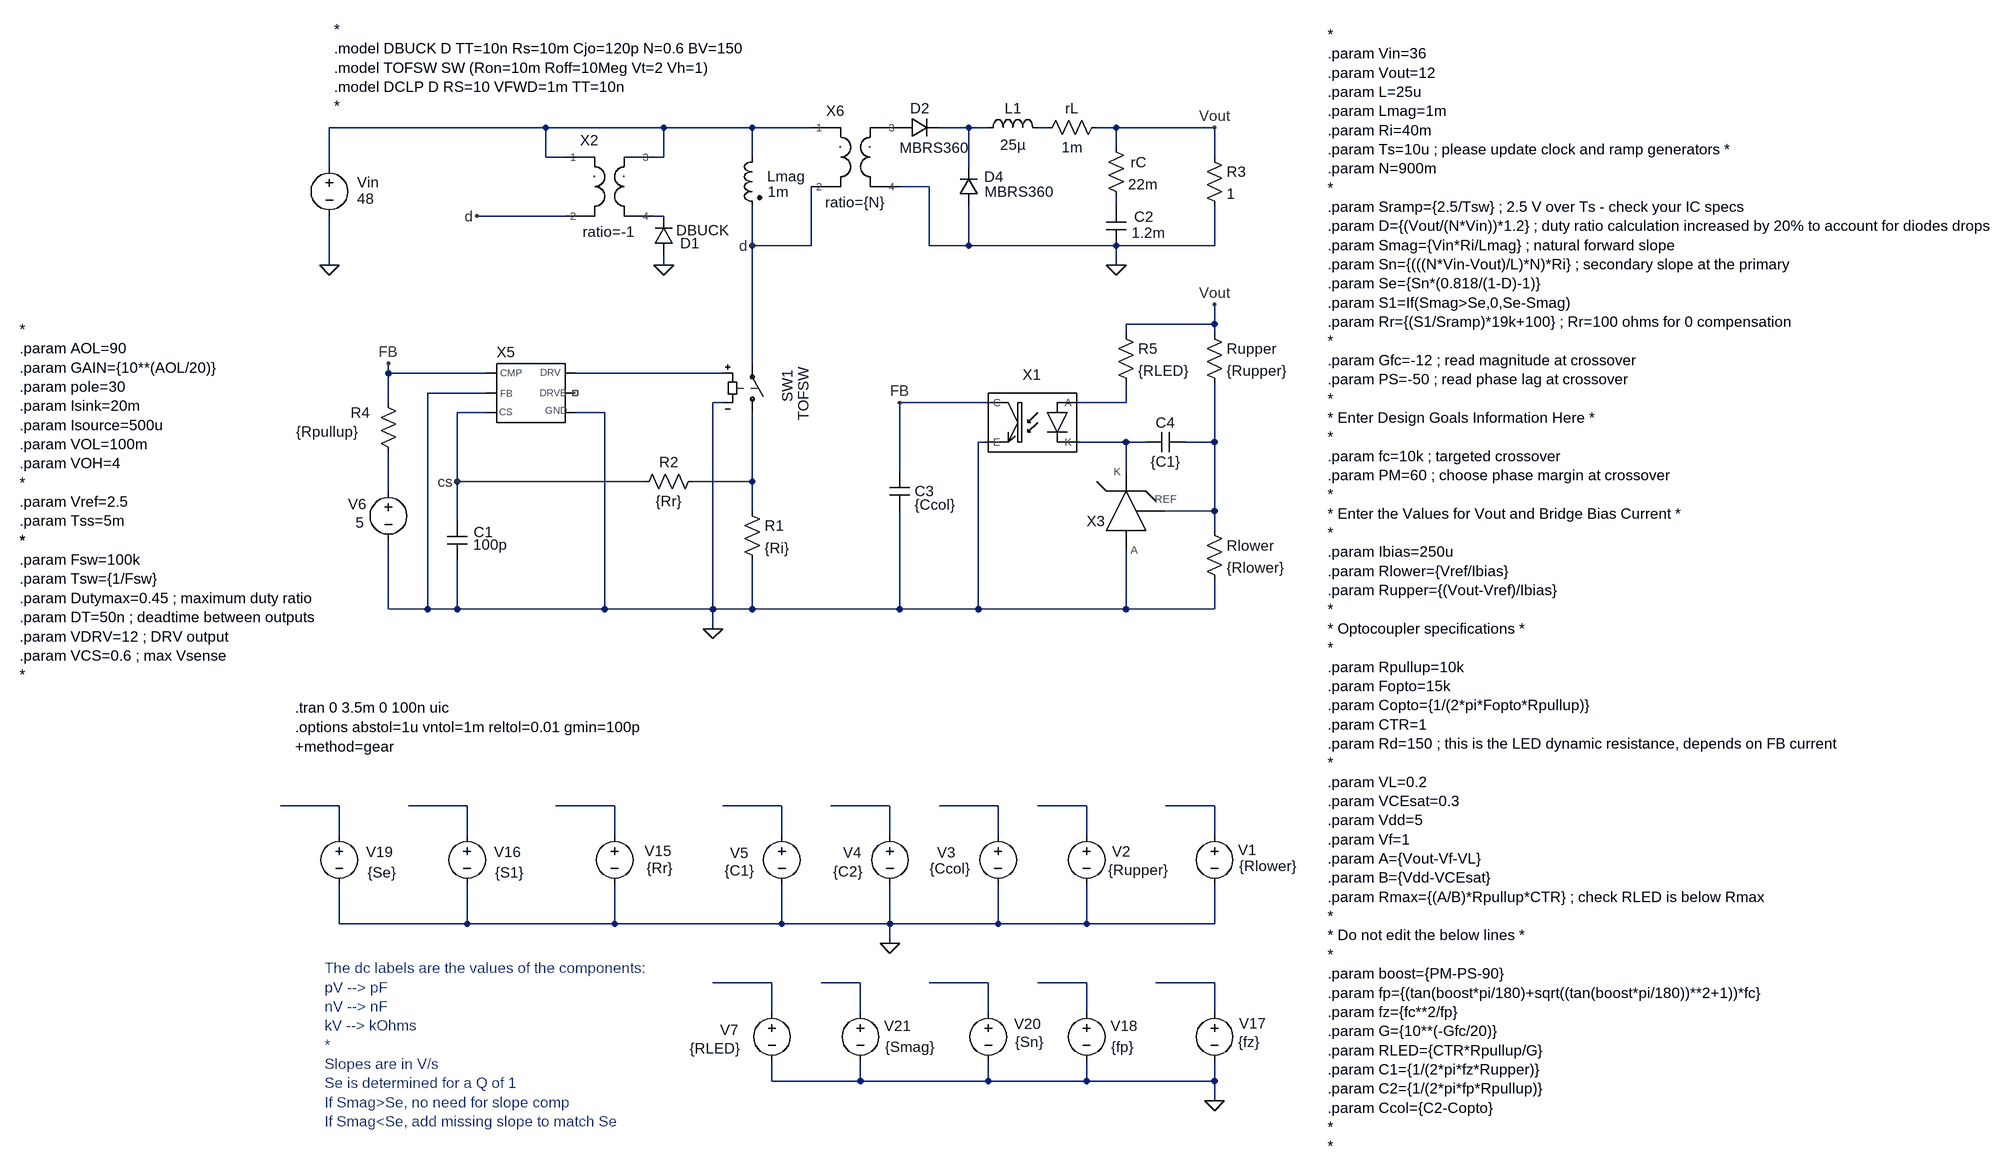
[diagram p0: schematic Forward CM - isolated - cbc.asc]
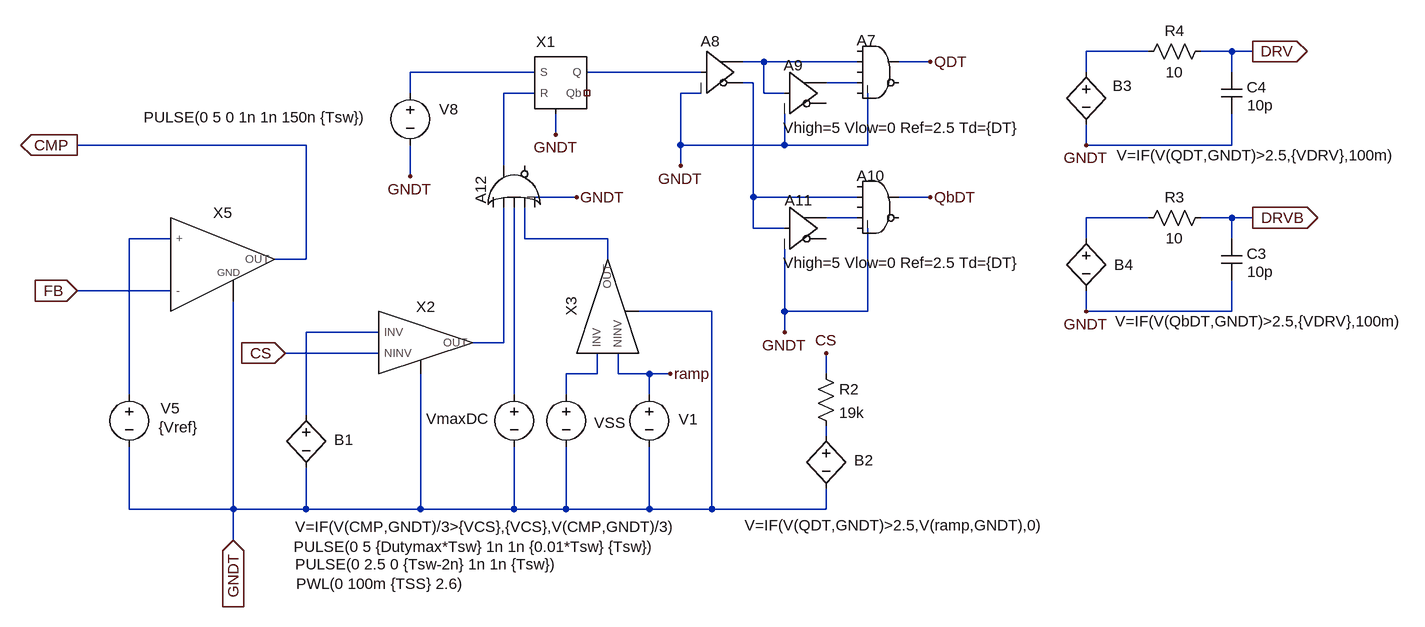
[diagram p1: sub-circuit generic_cm_pwm.asc]
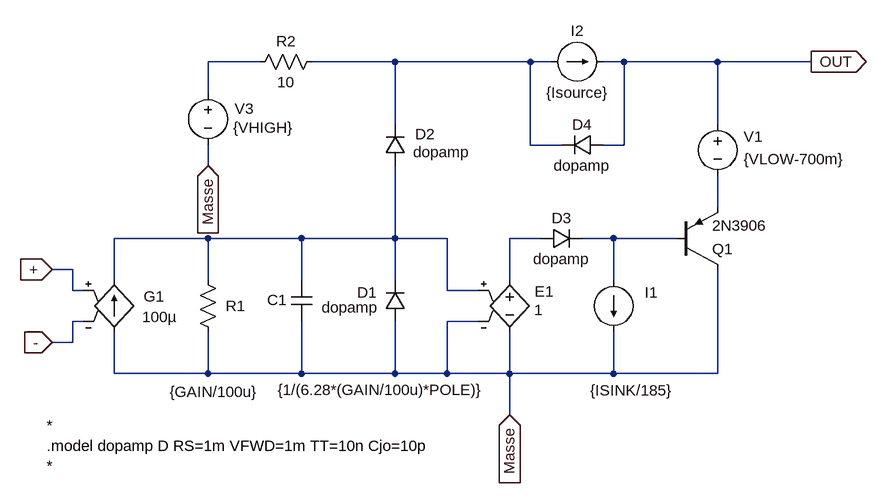
[diagram p2: sub-circuit op_amp_fan_out.asc]
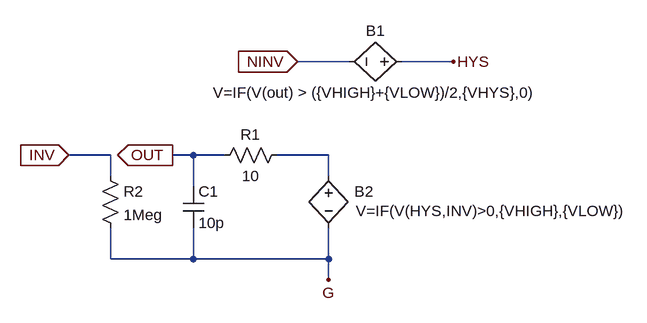
[diagram p3: sub-circuit comptof_g.asc]
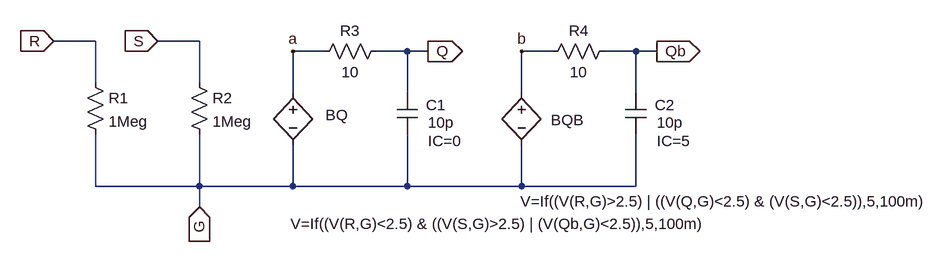
[diagram p4: sub-circuit sr_latch_g.asc]
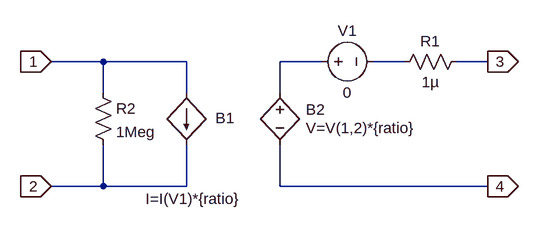
[diagram p5: sub-circuit xfmr.asc]
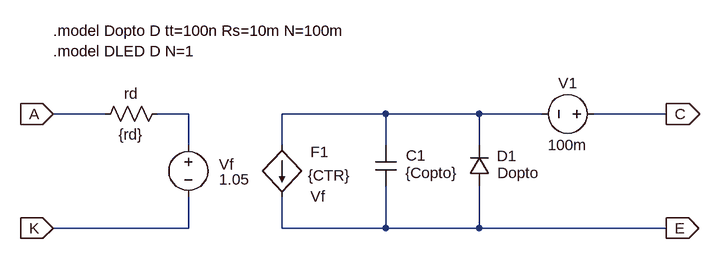
[diagram p6: sub-circuit optotof.asc]
Forward CM - isolated - cbc.asc, the LTspice schematic file:
Version 4.1
SHEET 1 2552 1992
WIRE -160 -208 -512 -208
WIRE 32 -208 -160 -208
WIRE 176 -208 32 -208
WIRE 272 -208 176 -208
WIRE 528 -208 480 -208
WIRE 560 -208 528 -208
WIRE 656 -208 640 -208
WIRE 768 -208 736 -208
WIRE 928 -208 768 -208
WIRE 768 -176 768 -208
WIRE -160 -160 -160 -208
WIRE -128 -160 -160 -160
WIRE 32 -160 32 -208
WIRE 32 -160 16 -160
WIRE 176 -160 176 -208
WIRE 928 -160 928 -208
WIRE -512 -144 -512 -208
WIRE 528 -144 528 -208
WIRE 464 -112 416 -112
WIRE 768 -80 768 -96
WIRE -128 -64 -272 -64
WIRE 32 -64 16 -64
WIRE 176 -16 176 -80
WIRE 272 -16 272 -112
WIRE 272 -16 176 -16
WIRE 464 -16 464 -112
WIRE 528 -16 528 -80
WIRE 528 -16 464 -16
WIRE 768 -16 528 -16
WIRE 928 -16 928 -80
WIRE 928 -16 768 -16
WIRE -512 16 -512 -64
WIRE 32 16 32 0
WIRE 768 16 768 -16
WIRE 928 112 928 80
WIRE 928 112 784 112
WIRE 784 128 784 112
WIRE 928 128 928 112
WIRE 176 176 176 -16
WIRE -416 192 -416 176
WIRE -256 192 -416 192
WIRE 128 192 -112 192
WIRE -256 224 -352 224
WIRE -416 240 -416 192
WIRE 128 240 112 240
WIRE 560 240 416 240
WIRE 784 240 784 208
WIRE 784 240 704 240
WIRE -256 256 -304 256
WIRE -64 256 -112 256
WIRE 560 304 544 304
WIRE 784 304 704 304
WIRE 816 304 784 304
WIRE 928 304 928 208
WIRE 928 304 880 304
WIRE 416 352 416 240
WIRE 784 352 784 304
WIRE -304 368 -304 256
WIRE 0 368 -304 368
WIRE 176 368 176 256
WIRE 176 368 80 368
WIRE -416 384 -416 320
WIRE 176 416 176 368
WIRE 928 416 928 304
WIRE 928 416 848 416
WIRE -304 432 -304 368
WIRE 928 448 928 416
WIRE -416 576 -416 464
WIRE -352 576 -352 224
WIRE -352 576 -416 576
WIRE -304 576 -304 496
WIRE -304 576 -352 576
WIRE -64 576 -64 256
WIRE -64 576 -304 576
WIRE 112 576 112 240
WIRE 112 576 -64 576
WIRE 176 576 176 496
WIRE 176 576 112 576
WIRE 416 576 416 416
WIRE 416 576 176 576
WIRE 544 576 544 304
WIRE 544 576 416 576
WIRE 784 576 784 480
WIRE 784 576 544 576
WIRE 928 576 928 528
WIRE 928 576 784 576
WIRE 112 608 112 576
WIRE -496 896 -592 896
WIRE -288 896 -384 896
WIRE -48 896 -144 896
WIRE 224 896 128 896
WIRE 400 896 304 896
WIRE 576 896 480 896
WIRE 720 896 640 896
WIRE 928 896 848 896
WIRE -496 944 -496 896
WIRE -288 944 -288 896
WIRE -48 944 -48 896
WIRE 224 944 224 896
WIRE 400 944 400 896
WIRE 576 944 576 896
WIRE 720 944 720 896
WIRE 928 944 928 896
WIRE -496 1088 -496 1024
WIRE -288 1088 -288 1024
WIRE -288 1088 -496 1088
WIRE -48 1088 -48 1024
WIRE -48 1088 -288 1088
WIRE 224 1088 224 1024
WIRE 224 1088 -48 1088
WIRE 400 1088 400 1024
WIRE 400 1088 224 1088
WIRE 576 1088 576 1024
WIRE 576 1088 400 1088
WIRE 720 1088 720 1024
WIRE 720 1088 576 1088
WIRE 928 1088 928 1024
WIRE 928 1088 720 1088
WIRE 400 1120 400 1088
WIRE 208 1184 112 1184
WIRE 352 1184 288 1184
WIRE 560 1184 464 1184
WIRE 720 1184 640 1184
WIRE 928 1184 832 1184
WIRE 208 1232 208 1184
WIRE 352 1232 352 1184
WIRE 560 1232 560 1184
WIRE 720 1232 720 1184
WIRE 928 1232 928 1184
WIRE 208 1344 208 1312
WIRE 352 1344 352 1312
WIRE 352 1344 208 1344
WIRE 560 1344 560 1312
WIRE 560 1344 352 1344
WIRE 720 1344 720 1312
WIRE 720 1344 560 1344
WIRE 928 1344 928 1312
WIRE 928 1344 720 1344
WIRE 928 1376 928 1344
FLAG 32 16 0
FLAG 768 16 0
FLAG -512 16 0
FLAG 928 -208 Vout
FLAG 176 -16 d
FLAG -272 -64 d
FLAG 112 608 0
FLAG 400 1120 0
FLAG 928 1376 0
FLAG -416 176 FB
FLAG 928 80 Vout
FLAG 416 240 FB
FLAG -304 368 cs
DATAFLAG 144 896 ""
DATAFLAG 336 896 ""
DATAFLAG 656 896 ""
DATAFLAG 880 896 ""
DATAFLAG -352 896 ""
DATAFLAG -112 896 ""
DATAFLAG 848 1184 ""
DATAFLAG 688 1184 ""
DATAFLAG -560 896 ""
DATAFLAG 480 1184 ""
DATAFLAG 320 1184 ""
DATAFLAG 512 896 ""
DATAFLAG 128 1184 ""
SYMBOL ind2 192 -176 M0
WINDOW 0 -69 47 Left 2
WINDOW 3 -43 72 Left 2
SYMATTR InstName Lmag
SYMATTR Value 1m
SYMATTR Type ind
SYMBOL sw 176 272 M180
WINDOW 3 83 89 VLeft 2
WINDOW 0 57 84 VLeft 2
SYMATTR Value TOFSW
SYMATTR InstName SW1
SYMBOL res 160 400 R0
SYMATTR InstName R1
SYMATTR Value {Ri}
SYMBOL res 96 352 R90
WINDOW 0 0 56 VBottom 2
WINDOW 3 32 56 VTop 2
SYMATTR InstName R2
SYMATTR Value {Rr}
SYMBOL diode 16 0 M180
WINDOW 0 43 20 Left 2
WINDOW 3 36 41 Left 2
SYMATTR InstName D1
SYMATTR Value DBUCK
SYMBOL diode 416 -224 M90
WINDOW 0 0 32 VBottom 2
WINDOW 3 33 55 VTop 2
SYMATTR InstName D2
SYMATTR Value MBRS360
SYMBOL ind 544 -192 R270
WINDOW 0 32 56 VTop 2
WINDOW 3 4 56 VBottom 2
SYMATTR InstName L1
SYMATTR Value 25µ
SYMBOL res 752 -224 R90
WINDOW 0 0 56 VBottom 2
WINDOW 3 32 56 VTop 2
SYMATTR InstName rL
SYMATTR Value 1m
SYMBOL res 752 -192 R0
WINDOW 0 40 40 Left 2
SYMATTR InstName rC
SYMATTR Value 22m
SYMBOL cap 752 -80 R0
WINDOW 0 45 17 Left 2
WINDOW 3 41 43 Left 2
SYMATTR InstName C2
SYMATTR Value 1.2m
SYMBOL res 912 -176 R0
SYMATTR InstName R3
SYMATTR Value 1
SYMBOL voltage -512 -160 R0
WINDOW 0 45 41 Left 2
WINDOW 3 45 68 Left 2
SYMATTR InstName Vin
SYMATTR Value 48
SYMBOL cap -320 432 R0
WINDOW 0 43 18 Left 2
WINDOW 3 42 39 Left 2
SYMATTR InstName C1
SYMATTR Value 100p
SYMBOL diode 512 -80 M180
WINDOW 0 41 48 Left 2
WINDOW 3 42 24 Left 2
SYMATTR InstName D4
SYMATTR Value MBRS360
SYMBOL voltage 928 928 R0
WINDOW 0 39 40 Left 2
WINDOW 3 40 66 Left 2
WINDOW 123 0 0 Left 0
WINDOW 39 0 0 Left 0
SYMATTR InstName V1
SYMATTR Value {Rlower}
SYMBOL voltage 720 928 R0
WINDOW 0 42 42 Left 2
WINDOW 3 35 72 Left 2
WINDOW 123 0 0 Left 0
WINDOW 39 0 0 Left 0
SYMATTR InstName V2
SYMATTR Value {Rupper}
SYMBOL voltage 400 928 R0
WINDOW 0 -76 44 Left 2
WINDOW 3 -92 75 Left 2
SYMATTR InstName V4
SYMATTR Value {C2}
SYMBOL voltage 224 928 R0
WINDOW 0 -84 45 Left 2
WINDOW 3 -93 73 Left 2
WINDOW 123 0 0 Left 0
WINDOW 39 0 0 Left 0
SYMATTR InstName V5
SYMATTR Value {C1}
SYMBOL voltage -48 928 R0
WINDOW 0 49 41 Left 2
WINDOW 3 52 69 Left 2
SYMATTR InstName V15
SYMATTR Value {Rr}
SYMBOL voltage -288 928 R0
WINDOW 0 44 43 Left 2
WINDOW 3 46 76 Left 2
SYMATTR InstName V16
SYMATTR Value {S1}
SYMBOL voltage 928 1216 R0
WINDOW 0 40 34 Left 2
WINDOW 3 39 64 Left 2
WINDOW 123 0 0 Left 0
WINDOW 39 0 0 Left 0
SYMATTR InstName V17
SYMATTR Value {fz}
SYMBOL voltage 720 1216 R0
WINDOW 0 39 38 Left 2
WINDOW 3 40 72 Left 2
SYMATTR InstName V18
SYMATTR Value {fp}
SYMBOL voltage -496 928 R0
WINDOW 0 44 43 Left 2
WINDOW 3 46 76 Left 2
SYMATTR InstName V19
SYMATTR Value {Se}
SYMBOL voltage 560 1216 R0
WINDOW 0 42 35 Left 2
WINDOW 3 44 64 Left 2
WINDOW 123 0 0 Left 0
WINDOW 39 0 0 Left 0
SYMATTR InstName V20
SYMATTR Value {Sn}
SYMBOL voltage 352 1216 R0
WINDOW 0 39 38 Left 2
WINDOW 3 40 72 Left 2
SYMATTR InstName V21
SYMATTR Value {Smag}
SYMBOL voltage -416 368 M0
WINDOW 0 36 37 Left 2
WINDOW 3 40 67 Left 2
SYMATTR InstName V6
SYMATTR Value 5
SYMBOL res -432 224 R0
WINDOW 3 -134 63 Left 2
WINDOW 0 -45 32 Left 2
SYMATTR Value {Rpullup}
SYMATTR InstName R4
SYMBOL res 912 432 R0
SYMATTR InstName Rlower
SYMATTR Value {Rlower}
SYMBOL res 912 112 R0
SYMATTR InstName Rupper
SYMATTR Value {Rupper}
SYMBOL cap 400 352 R0
WINDOW 0 40 32 Left 2
WINDOW 3 40 54 Left 2
SYMATTR InstName C3
SYMATTR Value {Ccol}
SYMBOL res 768 112 R0
SYMATTR InstName R5
SYMATTR Value {RLED}
SYMBOL cap 880 288 R90
WINDOW 0 0 32 VBottom 2
WINDOW 3 32 32 VTop 2
SYMATTR InstName C4
SYMATTR Value {C1}
SYMBOL voltage 576 928 R0
WINDOW 0 -99 44 Left 2
WINDOW 3 -111 70 Left 2
SYMATTR InstName V3
SYMATTR Value {Ccol}
SYMBOL voltage 208 1216 R0
WINDOW 0 -84 45 Left 2
WINDOW 3 -134 75 Left 2
WINDOW 123 0 0 Left 0
WINDOW 39 0 0 Left 0
SYMATTR InstName V7
SYMATTR Value {RLED}
SYMBOL TOF\\Subcircuits\\Generic_CM_PWM -192 192 R0
WINDOW 0 -33 -19 Bottom 2
SYMATTR InstName X5
SYMATTR SpiceLine gain={gain} pole={pole} Isink={Isink} Isource={Isource} Vlow={VOL} Vhigh={VOH}
SYMBOL TOF\\Subcircuits\\XFMR -96 -144 R0
WINDOW 0 7 -28 Bottom 2
WINDOW 39 38 121 Bottom 2
SYMATTR InstName X2
SYMATTR SpiceLine ratio=-1
SYMBOL TOF\\Subcircuits\\XFMR 304 -192 R0
WINDOW 0 7 -28 Bottom 2
WINDOW 39 38 121 Bottom 2
SYMATTR InstName X6
SYMATTR SpiceLine ratio={N}
SYMBOL TOF\\Subcircuits\\optoTOF 592 272 M0
SYMATTR InstName X1
SYMATTR SpiceLine Copto={Copto} Rd={Rd} CTR={CTR}
SYMBOL TOF\\Subcircuits\\TL431TOF 768 368 R0
WINDOW 0 -33 80 Bottom 2
SYMATTR InstName X3
TEXT -504 -368 Left 2 !*\n.model DBUCK D TT=10n Rs=10m Cjo=120p N=0.6 BV=150\n.model TOFSW SW (Ron=10m Roff=10Meg Vt=2 Vh=1)\n.model DCLP D RS=10 VFWD=1m TT=10n\n*
TEXT 1112 -360 Left 2 !*\n.param Vin=36\n.param Vout=12\n.param L=25u\n.param Lmag=1m\n.param Ri=40m\n.param Ts=10u ; please update clock and ramp generators *\n.param N=900m\n*\n.param Sramp={2.5/Tsw} ; 2.5 V over Ts - check your IC specs\n.param D={(Vout/(N*Vin))*1.2} ; duty ratio calculation increased by 20% to account for diodes drops\n.param Smag={Vin*Ri/Lmag} ; natural forward slope\n.param Sn={(((N*Vin-Vout)/L)*N)*Ri} ; secondary slope at the primary\n.param Se={Sn*(0.818/(1-D)-1)}\n.param S1=If(Smag>Se,0,Se-Smag)\n.param Rr={(S1/Sramp)*19k+100} ; Rr=100 ohms for 0 compensation\n*\n.param Gfc=-12 ; read magnitude at crossover\n.param PS=-50 ; read phase lag at crossover\n*\n* Enter Design Goals Information Here *\n*\n.param fc=10k ; targeted crossover\n.param PM=60 ; choose phase margin at crossover\n*\n* Enter the Values for Vout and Bridge Bias Current *\n*\n.param Ibias=250u\n.param Rlower={Vref/Ibias}\n.param Rupper={(Vout-Vref)/Ibias}\n*\n* Optocoupler specifications *\n*\n.param Rpullup=10k\n.param Fopto=15k\n.param Copto={1/(2*pi*Fopto*Rpullup)}\n.param CTR=1\n.param Rd=150 ; this is the LED dynamic resistance, depends on FB current\n*\n.param VL=0.2\n.param VCEsat=0.3\n.param Vdd=5\n.param Vf=1\n.param A={Vout-Vf-VL}\n.param B={Vdd-VCEsat}\n.param Rmax={(A/B)*Rpullup*CTR} ; check RLED is below Rmax\n*\n* Do not edit the below lines *\n*\n.param boost={PM-PS-90}\n.param fp={(tan(boost*pi/180)+sqrt((tan(boost*pi/180))**2+1))*fc}\n.param fz={fc**2/fp}\n.param G={10**(-Gfc/20)}\n.param RLED={CTR*Rpullup/G}\n.param C1={1/(2*pi*fz*Rupper)}\n.param C2={1/(2*pi*fp*Rpullup)}\n.param Ccol={C2-Copto}\n*\n*
TEXT -568 736 Left 2 !.tran 0 3.5m 0 100n uic
TEXT -568 768 Left 2 !.options abstol=1u vntol=1m reltol=0.01 gmin=100p\n+method=gear
TEXT -1016 464 Left 2 !*\n.param Fsw=100k\n.param Tsw={1/Fsw}\n.param Dutymax=0.45 ; maximum duty ratio\n.param DT=50n ; deadtime between outputs\n.param VDRV=12 ; DRV output\n.param VCS=0.6 ; max Vsense\n*
TEXT -1016 120 Left 2 !* \n.param AOL=90\n.param GAIN={10**(AOL/20)}\n.param pole=30\n.param Isink=20m\n.param Isource=500u\n.param VOL=100m\n.param VOH=4\n*\n.param Vref=2.5\n.param Tss=5m\n*
TEXT -520 1160 Left 2 ;The dc labels are the values of the components:\npV --> pF\nnV --> nF\nkV --> kOhms\n*\nSlopes are in V/s\nSe is determined for a Q of 1\nIf Smag>Se, no need for slope comp\nIf Smag<Se, add missing slope to match Se

generic_cm_pwm.asc, the sub-circuit schematic file:
Version 4.1
SHEET 1 1744 1720
WIRE 448 816 352 816
WIRE 576 816 528 816
WIRE 608 816 576 816
WIRE -144 832 -176 832
WIRE 0 832 -144 832
WIRE 112 832 64 832
WIRE -496 848 -688 848
WIRE -240 848 -416 848
WIRE 352 848 352 816
WIRE 576 848 576 816
WIRE -160 864 -176 864
WIRE 0 864 -48 864
WIRE -688 880 -688 848
WIRE -496 880 -544 880
WIRE -240 880 -272 880
WIRE -144 880 -144 832
WIRE -112 880 -144 880
WIRE -464 944 -464 912
WIRE -848 960 -1200 960
WIRE -272 960 -272 880
WIRE -112 960 -112 912
WIRE -112 960 -272 960
WIRE 16 960 16 880
WIRE 16 960 -112 960
WIRE 352 960 352 928
WIRE 576 960 576 912
WIRE 576 960 352 960
WIRE -544 992 -544 880
WIRE -272 992 -272 960
WIRE -688 1008 -688 960
WIRE -432 1040 -496 1040
WIRE -160 1040 -160 864
WIRE 0 1040 -160 1040
WIRE 112 1040 64 1040
WIRE 0 1072 -48 1072
WIRE 448 1072 352 1072
WIRE 576 1072 528 1072
WIRE 608 1072 576 1072
WIRE -160 1088 -160 1040
WIRE -112 1088 -160 1088
WIRE -1056 1104 -1120 1104
WIRE -512 1104 -512 1056
WIRE -384 1104 -512 1104
WIRE 352 1104 352 1072
WIRE 576 1104 576 1072
WIRE -848 1136 -848 960
WIRE -848 1136 -896 1136
WIRE -384 1136 -384 1104
WIRE -1056 1184 -1200 1184
WIRE -224 1216 -336 1216
WIRE -112 1216 -112 1120
WIRE 16 1216 16 1088
WIRE 16 1216 -112 1216
WIRE 352 1216 352 1184
WIRE 576 1216 576 1168
WIRE 576 1216 352 1216
WIRE -736 1248 -848 1248
WIRE -112 1248 -112 1216
WIRE -544 1264 -544 1056
WIRE -544 1264 -592 1264
WIRE -736 1280 -880 1280
WIRE -400 1312 -400 1280
WIRE -400 1312 -448 1312
WIRE -368 1312 -368 1280
WIRE -320 1312 -368 1312
WIRE -288 1312 -320 1312
WIRE -48 1312 -48 1280
WIRE -1120 1344 -1120 1104
WIRE -528 1344 -528 1056
WIRE -448 1344 -448 1312
WIRE -320 1344 -320 1312
WIRE -848 1376 -848 1248
WIRE -48 1408 -48 1392
WIRE -1120 1520 -1120 1424
WIRE -960 1520 -960 1200
WIRE -960 1520 -1120 1520
WIRE -848 1520 -848 1456
WIRE -848 1520 -960 1520
WIRE -672 1520 -672 1312
WIRE -672 1520 -848 1520
WIRE -528 1520 -528 1424
WIRE -528 1520 -672 1520
WIRE -448 1520 -448 1424
WIRE -448 1520 -528 1520
WIRE -320 1520 -320 1424
WIRE -320 1520 -448 1520
WIRE -224 1520 -224 1216
WIRE -224 1520 -320 1520
WIRE -48 1520 -48 1488
WIRE -48 1520 -224 1520
WIRE -960 1568 -960 1520
FLAG 112 832 QDT
FLAG 112 1040 QbDT
FLAG 352 1216 GNDT
FLAG 352 960 GNDT
FLAG 608 1072 DRVB
IOPIN 608 1072 Out
FLAG 608 816 DRV
IOPIN 608 816 Out
FLAG -1200 960 CMP
IOPIN -1200 960 Out
FLAG -1200 1184 FB
IOPIN -1200 1184 In
FLAG -880 1280 CS
IOPIN -880 1280 In
FLAG -960 1568 GNDT
IOPIN -960 1568 In
FLAG -688 1008 GNDT
FLAG -112 1248 GNDT
FLAG -272 992 GNDT
FLAG -464 944 GNDT
FLAG -432 1040 GNDT
FLAG -288 1312 ramp
FLAG -48 1280 CS
SYMBOL Digital\\and 32 784 R0
WINDOW 0 -33 15 Left 2
SYMATTR InstName A7
SYMATTR SpiceLine Vhigh=5 Vlow=0 Ref=2.5
SYMBOL Digital\\buf -240 784 R0
WINDOW 0 -1 16 Left 2
SYMATTR InstName A8
SYMATTR SpiceLine Vhigh=5 Vlow=0 Ref=1.0
SYMBOL Digital\\buf -112 816 R0
WINDOW 0 -1 21 Left 2
WINDOW 39 -2 117 Left 2
SYMATTR InstName A9
SYMATTR SpiceLine Vhigh=5 Vlow=0 Ref=2.5 Td={DT}
SYMBOL Digital\\and 32 992 R0
WINDOW 0 -33 15 Left 2
SYMATTR InstName A10
SYMATTR SpiceLine Vhigh=5 Vlow=0 Ref=2.5
SYMBOL Digital\\buf -112 1024 R0
WINDOW 0 0 21 Left 2
WINDOW 39 -2 117 Left 2
SYMATTR InstName A11
SYMATTR SpiceLine Vhigh=5 Vlow=0 Ref=2.5 Td={DT}
SYMBOL bv 352 832 R0
WINDOW 0 41 37 Left 2
WINDOW 3 47 144 Left 2
SYMATTR InstName B3
SYMATTR Value V=IF(V(QDT,GNDT)>2.5,{VDRV},100m)
SYMBOL bv 352 1088 R0
WINDOW 0 43 56 Left 2
WINDOW 3 45 143 Left 2
SYMATTR InstName B4
SYMATTR Value V=IF(V(QbDT,GNDT)>2.5,{VDRV},100m)
SYMBOL res 544 1056 R90
WINDOW 0 0 56 VBottom 2
WINDOW 3 32 56 VTop 2
SYMATTR InstName R3
SYMATTR Value 10
SYMBOL cap 560 1104 R0
WINDOW 0 39 23 Left 2
WINDOW 3 40 51 Left 2
SYMATTR InstName C3
SYMATTR Value 10p
SYMBOL res 544 800 R90
WINDOW 0 0 56 VBottom 2
WINDOW 3 32 56 VTop 2
SYMATTR InstName R4
SYMATTR Value 10
SYMBOL cap 560 848 R0
WINDOW 0 39 23 Left 2
WINDOW 3 40 51 Left 2
SYMATTR InstName C4
SYMATTR Value 10p
SYMBOL op_amp_fan_out -976 1136 R0
SYMATTR InstName X5
SYMATTR SpiceLine gain={gain} pole={pole} Isink={Isink} Isource={Isource} Vlow={VOL} Vhigh={VOH}
SYMBOL Digital\\or -592 1024 R270
WINDOW 0 -27 13 Left 2
SYMATTR InstName A12
SYMATTR SpiceLine Vhigh=5 Vlow=0 Ref=2.5
SYMBOL voltage -1120 1328 R0
WINDOW 0 48 37 Left 2
WINDOW 3 45 66 Left 2
SYMATTR InstName V5
SYMATTR Value {Vref}
SYMBOL voltage -688 864 R0
WINDOW 0 45 41 Left 2
WINDOW 3 -410 53 Left 2
WINDOW 123 0 0 Left 0
WINDOW 39 0 0 Left 0
SYMATTR InstName V8
SYMATTR Value PULSE(0 5 0 1n 1n 150n {Tsw})
SYMBOL voltage -528 1328 R0
WINDOW 0 -135 53 Left 2
WINDOW 3 -339 250 Left 2
WINDOW 123 0 0 Left 0
WINDOW 39 0 0 Left 0
SYMATTR InstName VmaxDC
SYMATTR Value PULSE(0 5 {Dutymax*Tsw} 1n 1n {0.01*Tsw} {Tsw})
SYMBOL bv -848 1360 R0
WINDOW 0 43 53 Left 2
WINDOW 3 -17 187 Left 2
SYMATTR InstName B1
SYMATTR Value V=IF(V(CMP,GNDT)/3>{VCS},{VCS},V(CMP,GNDT)/3)
SYMBOL voltage -320 1328 R0
WINDOW 0 45 54 Left 2
WINDOW 3 -545 277 Left 2
WINDOW 123 0 0 Left 0
WINDOW 39 0 0 Left 0
SYMATTR InstName V1
SYMATTR Value PULSE(0 2.5 0 {Tsw-2n} 1n 1n {Tsw})
SYMBOL voltage -448 1328 R0
WINDOW 0 43 59 Left 2
WINDOW 3 -415 307 Left 2
WINDOW 123 0 0 Left 0
WINDOW 39 0 0 Left 0
SYMATTR InstName VSS
SYMATTR Value PWL(0 100m {TSS} 2.6)
SYMBOL res -64 1296 R0
SYMATTR InstName R2
SYMATTR Value 19k
SYMBOL bv -48 1392 R0
WINDOW 0 43 53 Left 2
WINDOW 3 -125 153 Left 2
SYMATTR InstName B2
SYMATTR Value V=IF(V(QDT,GNDT)>2.5,V(ramp,GNDT),0)
SYMBOL TOF\\Subcircuits\\COMPTOF_G -672 1264 R0
SYMATTR InstName X2
SYMATTR SpiceLine VHIGH=5 VLOW=100m VHYS=10m
SYMBOL TOF\\Subcircuits\\COMPTOF_G -384 1216 R270
SYMATTR InstName X3
SYMATTR SpiceLine VHIGH=5 VLOW=100m VHYS=10m
SYMBOL TOF\\Subcircuits\\SR_latch_G -464 864 R0
WINDOW 0 -15 -47 Bottom 2
SYMATTR InstName X1

op_amp_fan_out.asc, the sub-circuit schematic file:
Version 4.1
SHEET 1 1504 680
WIRE 96 -224 16 -224
WIRE 304 -224 176 -224
WIRE 512 -224 304 -224
WIRE 544 -224 512 -224
WIRE 656 -224 624 -224
WIRE 800 -224 656 -224
WIRE 944 -224 800 -224
WIRE 16 -176 16 -224
WIRE 304 -128 304 -224
WIRE 800 -128 800 -224
WIRE 512 -96 512 -224
WIRE 560 -96 512 -96
WIRE 656 -96 656 -224
WIRE 656 -96 624 -96
WIRE 16 -64 16 -96
WIRE 800 0 800 -48
WIRE 16 48 -128 48
WIRE 160 48 16 48
WIRE 304 48 304 -64
WIRE 304 48 160 48
WIRE 384 48 304 48
WIRE 528 48 480 48
WIRE 640 48 592 48
WIRE 736 48 640 48
WIRE -192 96 -224 96
WIRE -128 112 -128 48
WIRE 16 112 16 48
WIRE 160 112 160 48
WIRE 304 112 304 48
WIRE 480 112 480 48
WIRE 640 112 640 48
WIRE -192 128 -192 96
WIRE -176 128 -192 128
WIRE 384 128 384 48
WIRE 432 128 384 128
WIRE -176 176 -192 176
WIRE 432 176 384 176
WIRE -192 208 -192 176
WIRE -192 208 -224 208
WIRE -128 256 -128 192
WIRE 16 256 16 192
WIRE 16 256 -128 256
WIRE 160 256 160 176
WIRE 160 256 16 256
WIRE 304 256 304 176
WIRE 304 256 160 256
WIRE 384 256 384 176
WIRE 384 256 304 256
WIRE 480 256 480 192
WIRE 480 256 384 256
WIRE 640 256 640 192
WIRE 640 256 480 256
WIRE 800 256 800 96
WIRE 800 256 640 256
WIRE 480 320 480 256
FLAG -224 96 +
IOPIN -224 96 In
FLAG -224 208 -
IOPIN -224 208 In
FLAG 944 -224 OUT
IOPIN 944 -224 Out
FLAG 480 320 Masse
IOPIN 480 320 In
FLAG 16 -64 Masse
IOPIN 16 -64 In
DATAFLAG 800 -16 ""
SYMBOL g -128 96 R0
WINDOW 0 45 41 Left 2
WINDOW 3 43 73 Left 2
SYMATTR InstName G1
SYMATTR Value 100µ
SYMBOL res 0 96 R0
WINDOW 0 43 56 Left 2
WINDOW 3 -43 188 Left 2
SYMATTR InstName R1
SYMATTR Value {GAIN/100u}
SYMBOL cap 144 112 R0
WINDOW 0 -37 31 Left 2
WINDOW 3 -21 169 Left 2
SYMATTR InstName C1
SYMATTR Value {1/(6.28*(GAIN/100u)*POLE)}
SYMBOL diode 320 176 R180
WINDOW 0 44 45 Left 2
WINDOW 3 41 22 Left 2
SYMATTR InstName D1
SYMATTR Value dopamp
SYMBOL e 480 96 R0
WINDOW 0 39 34 Left 2
WINDOW 3 38 62 Left 2
SYMATTR InstName E1
SYMATTR Value 1
SYMBOL diode 528 64 R270
WINDOW 0 32 32 VTop 2
WINDOW 3 0 32 VBottom 2
SYMATTR InstName D3
SYMATTR Value dopamp
SYMBOL current 640 112 R0
WINDOW 0 48 19 Left 2
WINDOW 3 -36 170 Left 2
SYMATTR InstName I1
SYMATTR Value {ISINK/185}
SYMBOL pnp 736 96 M180
SYMATTR InstName Q1
SYMATTR Value 2N3906
SYMBOL voltage 800 -144 R0
WINDOW 0 40 35 Left 2
WINDOW 3 40 70 Left 2
SYMATTR InstName V1
SYMATTR Value {VLOW-700m}
SYMBOL current 544 -224 R270
WINDOW 0 32 40 VTop 2
WINDOW 3 -32 40 VBottom 2
SYMATTR InstName I2
SYMATTR Value {Isource}
SYMBOL diode 624 -80 M270
WINDOW 0 32 32 VTop 2
WINDOW 3 0 32 VBottom 2
SYMATTR InstName D4
SYMATTR Value dopamp
SYMBOL voltage 16 -192 R0
WINDOW 0 41 40 Left 2
WINDOW 3 39 69 Left 2
SYMATTR InstName V3
SYMATTR Value {VHIGH}
SYMBOL diode 288 -64 M180
WINDOW 0 47 49 Left 2
WINDOW 3 44 21 Left 2
SYMATTR InstName D2
SYMATTR Value dopamp
SYMBOL res 192 -240 R90
WINDOW 0 0 56 VBottom 2
WINDOW 3 32 56 VTop 2
SYMATTR InstName R2
SYMATTR Value 10
TEXT -232 336 Left 2 !*\n.model dopamp D RS=1m VFWD=1m TT=10n Cjo=10p\n*

comptof_g.asc, the sub-circuit schematic file:
Version 4.1
SHEET 1 880 680
WIRE 64 192 -16 192
WIRE 224 192 144 192
WIRE -304 336 -368 336
WIRE -176 336 -208 336
WIRE -128 336 -176 336
WIRE 32 336 -48 336
WIRE -304 368 -304 336
WIRE 32 368 32 336
WIRE -176 384 -176 336
WIRE -304 496 -304 448
WIRE -176 496 -176 448
WIRE -176 496 -304 496
WIRE 32 496 32 448
WIRE 32 496 -176 496
WIRE 32 528 32 496
FLAG -16 192 NINV
IOPIN -16 192 In
FLAG 224 192 HYS
FLAG -208 336 OUT
IOPIN -208 336 Out
FLAG -368 336 INV
IOPIN -368 336 In
FLAG 32 528 G
SYMBOL bv 160 192 R90
WINDOW 0 -32 56 VBottom 2
WINDOW 3 32 56 VTop 2
SYMATTR InstName B1
SYMATTR Value V=IF(V(out) > ({VHIGH}+{VLOW})/2,{VHYS},0)
SYMBOL bv 32 352 R0
WINDOW 0 40 40 Left 2
WINDOW 3 42 70 Left 2
SYMATTR InstName B2
SYMATTR Value V=IF(V(HYS,INV)>0,{VHIGH},{VLOW})
SYMBOL res -32 320 R90
WINDOW 0 0 56 VBottom 2
WINDOW 3 32 56 VTop 2
SYMATTR InstName R1
SYMATTR Value 10
SYMBOL cap -192 384 R0
SYMATTR InstName C1
SYMATTR Value 10p
SYMBOL res -320 352 R0
SYMATTR InstName R2
SYMATTR Value 1Meg

sr_latch_g.asc, the sub-circuit schematic file:
Version 4.1
SHEET 1 1168 680
WIRE -192 48 -256 48
WIRE -32 48 -96 48
WIRE 160 64 112 64
WIRE 288 64 240 64
WIRE 320 64 288 64
WIRE 512 64 464 64
WIRE 640 64 592 64
WIRE 672 64 640 64
WIRE -192 112 -192 48
WIRE -32 112 -32 48
WIRE 112 128 112 64
WIRE 288 128 288 64
WIRE 464 128 464 64
WIRE 640 128 640 64
WIRE -192 272 -192 192
WIRE -32 272 -32 192
WIRE -32 272 -192 272
WIRE 112 272 112 208
WIRE 112 272 -32 272
WIRE 288 272 288 192
WIRE 288 272 112 272
WIRE 464 272 464 208
WIRE 464 272 288 272
WIRE 640 272 640 192
WIRE 640 272 464 272
WIRE -32 304 -32 272
FLAG -256 48 R
IOPIN -256 48 In
FLAG -96 48 S
IOPIN -96 48 In
FLAG 320 64 Q
IOPIN 320 64 Out
FLAG 672 64 Qb
IOPIN 672 64 Out
FLAG 112 64 a
FLAG 464 64 b
FLAG -32 304 G
IOPIN -32 304 In
SYMBOL bv 112 112 R0
WINDOW 0 50 50 Left 2
WINDOW 3 -4 218 Left 2
SYMATTR InstName BQ
SYMATTR Value V=If((V(R,G)<2.5) & ((V(S,G)>2.5) | (V(Qb,G)<2.5)),5,100m)
SYMBOL res -208 96 R0
SYMATTR InstName R1
SYMATTR Value 1Meg
SYMBOL res -48 96 R0
SYMATTR InstName R2
SYMATTR Value 1Meg
SYMBOL res 256 48 R90
WINDOW 0 0 56 VBottom 2
WINDOW 3 32 56 VTop 2
SYMATTR InstName R3
SYMATTR Value 10
SYMBOL cap 272 128 R0
WINDOW 0 45 19 Left 2
WINDOW 3 48 46 Left 2
WINDOW 123 48 74 Left 2
SYMATTR InstName C1
SYMATTR Value 10p
SYMATTR Value2 IC=0
SYMBOL bv 464 112 R0
WINDOW 0 45 58 Left 2
WINDOW 3 -2 183 Left 2
SYMATTR InstName BQB
SYMATTR Value V=If((V(R,G)>2.5) | ((V(Q,G)<2.5) & (V(S,G)<2.5)),5,100m)
SYMBOL res 608 48 R90
WINDOW 0 0 56 VBottom 2
WINDOW 3 32 56 VTop 2
SYMATTR InstName R4
SYMATTR Value 10
SYMBOL cap 624 128 R0
WINDOW 0 45 19 Left 2
WINDOW 3 48 46 Left 2
WINDOW 123 48 74 Left 2
SYMATTR InstName C2
SYMATTR Value 10p
SYMATTR Value2 IC=5

xfmr.asc, the sub-circuit schematic file:
Version 4.1
SHEET 1 880 680
WIRE 32 96 -48 96
WIRE 160 96 32 96
WIRE 368 96 304 96
WIRE 496 96 448 96
WIRE 624 96 576 96
WIRE 32 144 32 96
WIRE 160 144 160 96
WIRE 304 144 304 96
WIRE 32 288 32 224
WIRE 32 288 -48 288
WIRE 160 288 160 224
WIRE 160 288 32 288
WIRE 304 288 304 224
WIRE 624 288 304 288
FLAG 624 288 4
IOPIN 624 288 Out
FLAG 624 96 3
IOPIN 624 96 Out
FLAG -48 96 1
IOPIN -48 96 In
FLAG -48 288 2
IOPIN -48 288 In
SYMBOL bi 160 144 R0
WINDOW 0 45 39 Left 2
WINDOW 3 -63 163 Left 2
SYMATTR InstName B1
SYMATTR Value I=I(V1)*{ratio}
SYMBOL bv 304 128 R0
WINDOW 0 40 42 Left 2
WINDOW 3 40 70 Left 2
SYMATTR InstName B2
SYMATTR Value V=V(1,2)*{ratio}
SYMBOL voltage 352 96 R270
WINDOW 0 32 56 VTop 2
WINDOW 3 -32 56 VBottom 2
WINDOW 123 0 0 Left 0
WINDOW 39 0 0 Left 0
SYMATTR InstName V1
SYMATTR Value 0
SYMBOL res 592 80 R90
WINDOW 0 0 56 VBottom 2
WINDOW 3 32 56 VTop 2
SYMATTR InstName R1
SYMATTR Value 1µ
SYMBOL res 16 128 R0
SYMATTR InstName R2
SYMATTR Value 1Meg

optotof.asc, the sub-circuit schematic file:
Version 4
SHEET 1 892 680
WIRE -48 32 -128 32
WIRE 80 32 32 32
WIRE 384 32 224 32
WIRE 528 32 384 32
WIRE 624 32 528 32
WIRE 816 32 704 32
WIRE 80 80 80 32
WIRE 224 80 224 32
WIRE 384 80 384 32
WIRE 528 80 528 32
WIRE 80 208 80 160
WIRE 80 208 -128 208
WIRE 224 208 224 160
WIRE 384 208 384 144
WIRE 384 208 224 208
WIRE 528 208 528 144
WIRE 528 208 384 208
WIRE 816 208 528 208
FLAG -128 32 A
IOPIN -128 32 In
FLAG -128 208 K
IOPIN -128 208 In
FLAG 816 32 C
IOPIN 816 32 Out
FLAG 816 208 E
IOPIN 816 208 Out
SYMBOL f 224 80 R0
WINDOW 0 44 11 Left 2
WINDOW 3 40 47 Left 2
WINDOW 38 44 79 Left 2
SYMATTR InstName F1
SYMATTR Value {CTR}
SYMATTR SpiceModel Vf
SYMBOL res 48 16 R90
WINDOW 0 0 56 VBottom 2
WINDOW 3 32 56 VTop 2
SYMATTR InstName rd
SYMATTR Value {rd}
SYMBOL voltage 80 64 R0
WINDOW 0 47 46 Left 2
WINDOW 3 47 69 Left 2
WINDOW 123 0 0 Left 0
WINDOW 39 0 0 Left 0
SYMATTR InstName Vf
SYMATTR Value 1.05
SYMBOL voltage 720 32 R90
WINDOW 0 -32 56 VBottom 2
WINDOW 3 32 56 VTop 2
SYMATTR InstName V1
SYMATTR Value 100m
SYMBOL cap 368 80 R0
WINDOW 0 47 16 Left 2
WINDOW 3 46 43 Left 2
SYMATTR InstName C1
SYMATTR Value {Copto}
SYMBOL diode 512 144 M180
WINDOW 0 43 47 Left 2
WINDOW 3 44 21 Left 2
SYMATTR InstName D1
SYMATTR Value Dopto
TEXT -128 -96 Left 2 !.model Dopto D tt=100n Rs=10m N=100m\n.model DLED D N=1

The netlist it stands for:
* Forward CM - isolated - cbc.asc
Lmag N001 d 1m
SW1 N010 d N006 0 TOFSW
R1 N010 0 {Ri}
R2 N010 cs {Rr}
D1 0 N005 DBUCK
D2 P001 N002 MBRS360
L1 N002 N003 25µ
rL Vout N003 1m
rC Vout N004 22m
C2 N004 0 1.2m
R3 Vout 0 1
Vin N001 0 48
C1 cs 0 100p
D4 0 N002 MBRS360
V1 N019 0 {Rlower}
V2 N018 0 {Rupper}
V4 N016 0 {C2}
V5 N015 0 {C1}
V15 N014 0 {Rr}
V16 N013 0 {S1}
V17 N024 0 {fz}
V18 N023 0 {fp}
V19 N012 0 {Se}
V20 N022 0 {Sn}
V21 N021 0 {Smag}
V6 N011 0 5
R4 FB N011 {Rpullup}
Rlower N009 0 {Rlower}
Rupper Vout N009 {Rupper}
C3 FB 0 {Ccol}
R5 Vout N007 {RLED}
C4 N009 N008 {C1}
V3 N017 0 {Ccol}
V7 N020 0 {RLED}
X§X5 cs 0 0 FB N006 NC_01 generic_cm_pwm params: gain={gain} pole={pole} Isink={Isink} Isource={Isource} Vlow={VOL} Vhigh={VOH}
X§X2 N001 d N001 N005 xfmr params: ratio=-1
X§X6 N001 d P001 0 xfmr params: ratio={N}
X§X1 N007 N008 FB 0 optotof params: Copto={Copto} Rd={Rd} CTR={CTR}
X§X3 0 N009 N008 TL431TOF  ; pins A REF K

* block symbol definitions
.subckt generic_cm_pwm CS FB GNDT CMP DRV DRVB
A7 GNDT N002 GNDT N006 GNDT GNDT QDT GNDT AND Vhigh=5 Vlow=0 Ref=2.5
A8 N004 GNDT GNDT GNDT GNDT N005 N002 GNDT BUF Vhigh=5 Vlow=0 Ref=1.0
A9 N002 GNDT GNDT GNDT GNDT GNDT N006 GNDT BUF Vhigh=5 Vlow=0 Ref=2.5 Td={DT}
A10 GNDT N005 GNDT N008 GNDT GNDT QbDT GNDT AND Vhigh=5 Vlow=0 Ref=2.5
A11 N005 GNDT GNDT GNDT GNDT GNDT N008 GNDT BUF Vhigh=5 Vlow=0 Ref=2.5 Td={DT}
B3 N001 GNDT V=IF(V(QDT,GNDT)>2.5,{VDRV},100m)
B4 N009 GNDT V=IF(V(QbDT,GNDT)>2.5,{VDRV},100m)
R3 DRVB N009 10
C3 DRVB GNDT 10p
R4 DRV N001 10
C4 DRV GNDT 10p
X§X5 N010 FB GNDT CMP op_amp_fan_out params: gain={gain} pole={pole} Isink={Isink} Isource={Isource} Vlow={VOL} Vhigh={VOH}
A12 GNDT N013 N015 N011 GNDT GNDT N007 GNDT OR Vhigh=5 Vlow=0 Ref=2.5
V5 N010 GNDT {Vref}
V8 N003 GNDT PULSE(0 5 0 1n 1n 150n {Tsw})
VmaxDC N015 GNDT PULSE(0 5 {Dutymax*Tsw} 1n 1n {0.01*Tsw} {Tsw})
B1 N012 GNDT V=IF(V(CMP,GNDT)/3>{VCS},{VCS},V(CMP,GNDT)/3)
V1 ramp GNDT PULSE(0 2.5 0 {Tsw-2n} 1n 1n {Tsw})
VSS N014 GNDT PWL(0 100m {TSS} 2.6)
R2 CS N016 19k
B2 N016 GNDT V=IF(V(QDT,GNDT)>2.5,V(ramp,GNDT),0)
X§X2 N012 CS N013 GNDT comptof_g params: VHIGH=5 VLOW=100m VHYS=10m
X§X3 N014 ramp N011 GNDT comptof_g params: VHIGH=5 VLOW=100m VHYS=10m
X§X1 N007 N003 N004 NC_01 GNDT sr_latch_g
.ends generic_cm_pwm

.subckt op_amp_fan_out + - Masse OUT
G1 Masse N004 + - 100µ
R1 N004 Masse {GAIN/100u}
C1 N004 Masse {1/(6.28*(GAIN/100u)*POLE)}
D1 Masse N004 dopamp
E1 N005 Masse N004 Masse 1
D3 N005 N006 dopamp
I1 N006 Masse {ISINK/185}
Q1 Masse N006 N003 0 2N3906
V1 OUT N003 {VLOW-700m}
I2 N002 OUT {Isource}
D4 OUT N002 dopamp
V3 N001 Masse {VHIGH}
D2 N004 N002 dopamp
R2 N002 N001 10
*
.model dopamp D RS=1m VFWD=1m TT=10n Cjo=10p
*
.ends op_amp_fan_out

.subckt comptof_g INV NINV OUT G
B1 HYS NINV V=IF(V(out) > ({VHIGH}+{VLOW})/2,{VHYS},0)
B2 N001 G V=IF(V(HYS,INV)>0,{VHIGH},{VLOW})
R1 N001 OUT 10
C1 OUT G 10p
R2 INV G 1Meg
.ends comptof_g

.subckt sr_latch_g R S Q Qb G
BQ a G V=If((V(R,G)<2.5) & ((V(S,G)>2.5) | (V(Qb,G)<2.5)),5,100m)
R1 R G 1Meg
R2 S G 1Meg
R3 Q a 10
C1 Q G 10p IC=0
BQB b G V=If((V(R,G)>2.5) | ((V(Q,G)<2.5) & (V(S,G)<2.5)),5,100m)
R4 Qb b 10
C2 Qb G 10p IC=5
.ends sr_latch_g

.subckt xfmr 1 2 3 4
B1 1 2 I=I(V1)*{ratio}
B2 N001 4 V=V(1,2)*{ratio}
V1 N001 N002 0
R1 3 N002 1µ
R2 1 2 1Meg
.ends xfmr

.subckt optotof A K C E
F1 N002 E Vf {CTR}
rd N001 A {rd}
Vf N001 K 1.05
V1 C N002 100m
C1 N002 E {Copto}
D1 E N002 Dopto
.model Dopto D tt=100n Rs=10m N=100m
.model DLED D N=1
.ends optotof

.model D D
.lib standard.dio
.model NPN NPN
.model PNP PNP
.lib standard.bjt
*
.model DBUCK D TT=10n Rs=10m Cjo=120p N=0.6 BV=150
.model TOFSW SW (Ron=10m Roff=10Meg Vt=2 Vh=1)
.model DCLP D RS=10 VFWD=1m TT=10n
*
*
.param Vin=36
.param Vout=12
.param L=25u
.param Lmag=1m
.param Ri=40m
.param Ts=10u ; please update clock and ramp generators *
.param N=900m
*
.param Sramp={2.5/Tsw} ; 2.5 V over Ts - check your IC specs
.param D={(Vout/(N*Vin))*1.2} ; duty ratio calculation increased by 20% to account for diodes drops
.param Smag={Vin*Ri/Lmag} ; natural forward slope
.param Sn={(((N*Vin-Vout)/L)*N)*Ri} ; secondary slope at the primary
.param Se={Sn*(0.818/(1-D)-1)}
.param S1=If(Smag>Se,0,Se-Smag)
.param Rr={(S1/Sramp)*19k+100} ; Rr=100 ohms for 0 compensation
*
.param Gfc=-12 ; read magnitude at crossover
.param PS=-50 ; read phase lag at crossover
*
* Enter Design Goals Information Here *
*
.param fc=10k ; targeted crossover
.param PM=60 ; choose phase margin at crossover
*
* Enter the Values for Vout and Bridge Bias Current *
*
.param Ibias=250u
.param Rlower={Vref/Ibias}
.param Rupper={(Vout-Vref)/Ibias}
*
* Optocoupler specifications *
*
.param Rpullup=10k
.param Fopto=15k
.param Copto={1/(2*pi*Fopto*Rpullup)}
.param CTR=1
.param Rd=150 ; this is the LED dynamic resistance, depends on FB current
*
.param VL=0.2
.param VCEsat=0.3
.param Vdd=5
.param Vf=1
.param A={Vout-Vf-VL}
.param B={Vdd-VCEsat}
.param Rmax={(A/B)*Rpullup*CTR} ; check RLED is below Rmax
*
* Do not edit the below lines *
*
.param boost={PM-PS-90}
.param fp={(tan(boost*pi/180)+sqrt((tan(boost*pi/180))**2+1))*fc}
.param fz={fc**2/fp}
.param G={10**(-Gfc/20)}
.param RLED={CTR*Rpullup/G}
.param C1={1/(2*pi*fz*Rupper)}
.param C2={1/(2*pi*fp*Rpullup)}
.param Ccol={C2-Copto}
*
*
.tran 0 3.5m 0 100n uic
.options abstol=1u vntol=1m reltol=0.01 gmin=100p
+method=gear
*
.param Fsw=100k
.param Tsw={1/Fsw}
.param Dutymax=0.45 ; maximum duty ratio
.param DT=50n ; deadtime between outputs
.param VDRV=12 ; DRV output
.param VCS=0.6 ; max Vsense
*
*
.param AOL=90
.param GAIN={10**(AOL/20)}
.param pole=30
.param Isink=20m
.param Isource=500u
.param VOL=100m
.param VOH=4
*
.param Vref=2.5
.param Tss=5m
*
* The dc labels are the values of the components:
* pV --> pF
* nV --> nF
* kV --> kOhms
* *
* Slopes are in V/s
* Se is determined for a Q of 1
* If Smag>Se, no need for slope comp
* If Smag<Se, add missing slope to match Se
.backanno
.end